# Altium schematic sheet Sensors.SchDoc
size A4; SheetNumber: 2; SheetTotal: 4
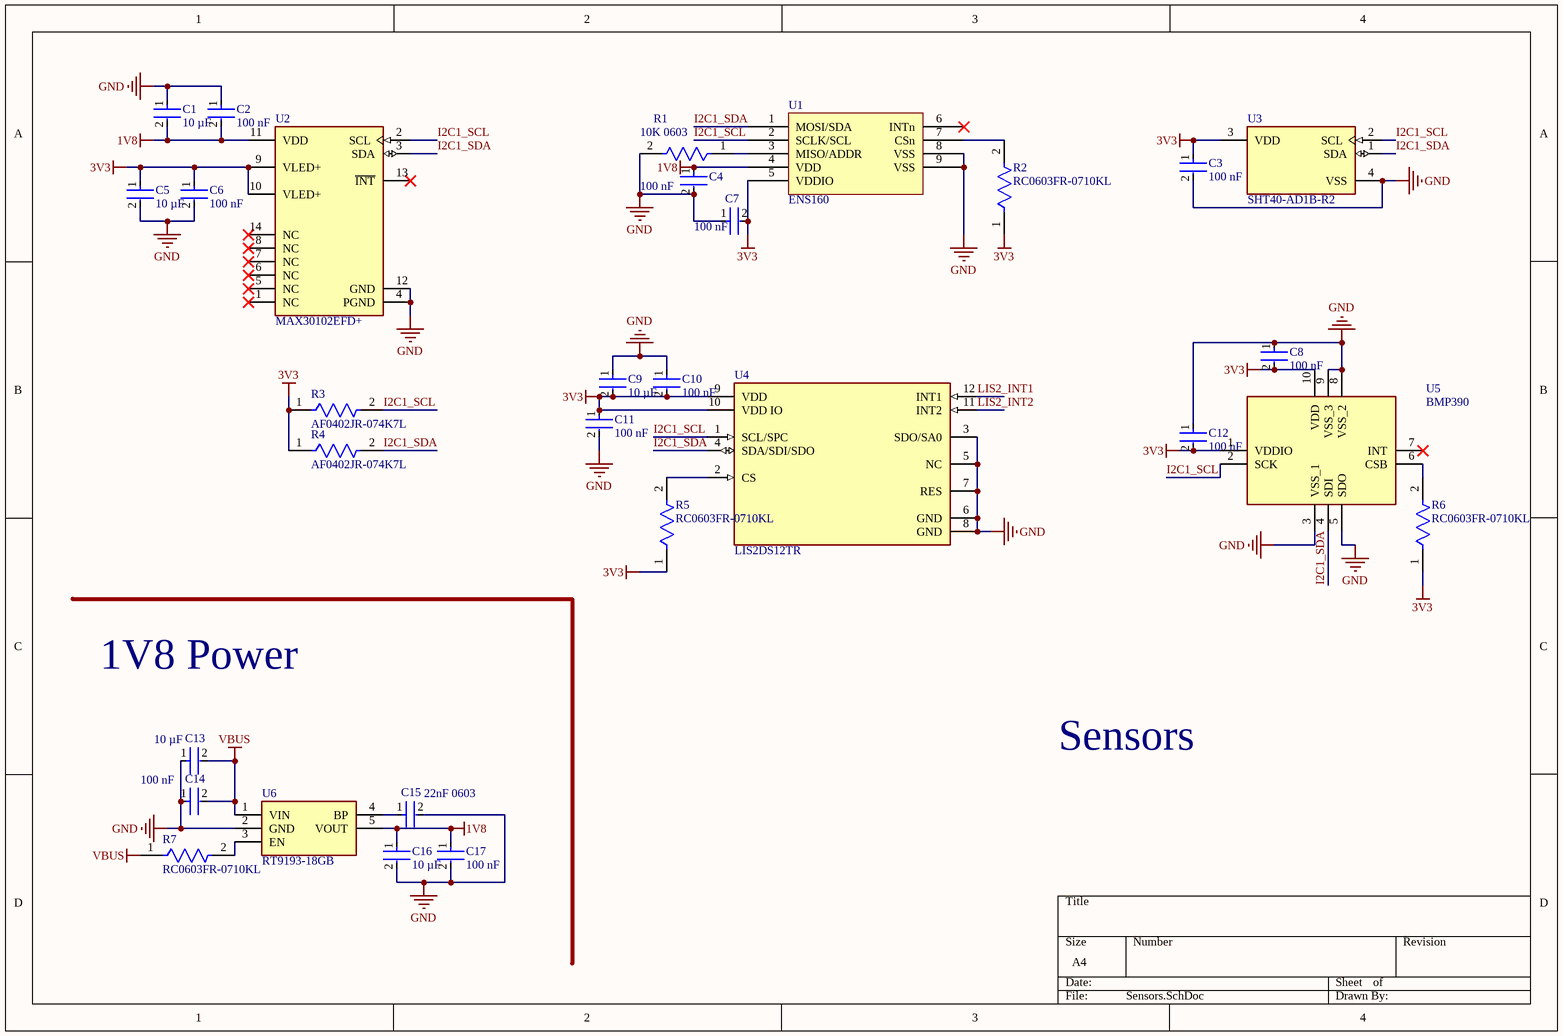
[diagram p0: Sensors.SchDoc]

## Parts
C1  10 µF  [FP-CL10-IPC_C]
C2  100 nF  [FP-CL10-IPC_A]
C3  100 nF  [FP-CL10-IPC_A]
C4  100 nF  [FP-CL10-IPC_A]
C5  10 µF  [FP-CL10-IPC_C]
C6  100 nF  [FP-CL10-IPC_A]
C7  100 nF  [FP-CL10-IPC_A]
C8  100 nF  [FP-CL10-IPC_A]
C9  10 µF  [FP-CL10-IPC_C]
C10  100 nF  [FP-CL10-IPC_A]
C11  100 nF  [FP-CL10-IPC_A]
C12  100 nF  [FP-CL10-IPC_A]
C13  10 µF  [FP-CL10-IPC_C]
C14  100 nF  [FP-CL10-IPC_A]
C15  22nF 0603  [FP-0603-L_1_6_0_15-W_0_81-IPC_C]
C16  10 µF  [FP-CL10-IPC_C]
C17  100 nF  [FP-CL10-IPC_A]
R1  10K 0603  [FP-RC0603-0_55-IPC_C]
R2  RC0603FR-0710KL  [FP-RC0603-0_55-IPC_C]
R3  AF0402JR-074K7L  [FP-AF0402-IPC_B]
R4  AF0402JR-074K7L  [FP-AF0402-IPC_B]
R5  RC0603FR-0710KL  [FP-RC0603-0_55-IPC_C]
R6  RC0603FR-0710KL  [FP-RC0603-0_55-IPC_C]
R7  RC0603FR-0710KL  [FP-RC0603-0_55-IPC_C]
U1  ENS160  [ENS_160]
U2  MAX30102EFD+  [FP-F143A5-1-MFG]
U3  SHT40-AD1B-R2  [FP-SHT40-AD1B-R2-MFG]
U4  LIS2DS12TR  [FP-LGA12_8566956-MFG]
U5  BMP390  [BMP390]
U6  RT9193-18GB  [SOT94P279X130-5N]

## Nets
1V8: C1.2 C2.2 C4.1 C16.1 C17.1 U1.4(VDD) U2.11(VDD) U6.5(VOUT)
3V3: C3.1 C5.1 C6.1 C7.2 C8.2 C9.2 C10.2 C11.1 C12.2 R2.1 R3.1 R4.1 R5.1 R6.1 U1.5(VDDIO) U2.9(VLED+) U2.10(VLED+) U3.3(VDD) U4.9(VDD) U4.10(VDD_IO) U5.1(VDDIO) U5.10(VDD)
GND: C1.1 C2.1 C3.2 C4.2 C5.2 C6.2 C7.1 C8.1 C9.1 C10.1 C11.2 C12.1 C13.1 C14.1 C15.2 C16.2 C17.2 R1.2 U1.8(VSS) U1.9(VSS) U2.4(PGND) U2.12(GND) U3.4(VSS) U4.3(SDO/SA0) U4.5(NC) U4.6(GND) U4.7(RES) U4.8(GND) U5.3(VSS_1) U5.5(SDO) U5.8(VSS_2) U5.9(VSS_3) U6.2(GND)
VBUS: C13.2 C14.2 R7.1 U6.1(VIN)
I2C1_SCL: R3.2 U1.2(SCLK/SCL) U2.2(SCL) U3.2(SCL) U4.1(SCL/SPC) U5.2(SCK)
I2C1_SDA: R4.2 U1.1(MOSI/SDA) U2.3(SDA) U3.1(SDA) U4.4(SDA/SDI/SDO) U5.4(SDI)
LIS2_INT1: U4.12(INT1)
LIS2_INT2: U4.11(INT2)
NetC15_1: C15.1 U6.4(BP)
NetR1_1: R1.1 U1.3(MISO/ADDR)
NetR2_2: R2.2 U1.7(CSn)
NetR5_2: R5.2 U4.2(CS)
NetR6_2: R6.2 U5.6(CSB)
NetR7_2: R7.2 U6.3(EN)

Not connected (* = marked no-connect by the designer): U1 6(INTn)*; U2 1(NC)* 5(NC)* 6(NC)* 7(NC)* 8(NC)* 13(~{INT})* 14(NC)*; U5 7(INT)*

## Notes on the sheet
- 1V8 Power
- Sensors

## Library data of the parts
C1 C5 C9 C13 C16 = CMP-13271-004224-1: Cap Ceramic 10uF 25V X5R ±20% Pad SMD 0603 +85°C T/R; Width: 0.031inch; Voltage Rating: 25V; Length: 0.063inch; Case Code (Metric): 1608; Dielectric: X5R; Termination: Wraparound; Capacitance: 10uF; Lead Free: Lead Free; Mount: Surface Mount; Package Quantity: 1; Case Code (Imperial): 0603; Thickness: 0.035inch; Packaging: Tape and Reel; Contact Plating: Tin; Min Operating Temperature: -55°C; Tolerance: 20%; Max Operating Temperature: 85°C; Case/Package: 0603
C2-C4 C6-C8 C10-C12 C14 C17 = CMP-13271-004036-1: Cap Ceramic 100nF 100V X7R ±10% Pad SMD 0603 +125°C T/R; Mount: Surface Mount; Packaging: Cut Tape; Width: 0.031inch; Thickness: 0.035inch; Length: 0.063inch; Tolerance: 10%; Min Operating Temperature: -55°C; Case/Package: 0603; Voltage Rating: 100V; Max Operating Temperature: 125°C; Case Code (Metric): 1608; Capacitance: 100nF; Case Code (Imperial): 0603
C15 = CMP-2006-04170-2: General Purpose Ceramic Capacitor, 0603, 22nF, 10%, X7R, 15%, 25V; Max Operating Temperature: 125°C; Lead Free: Lead Free; Voltage Rating (DC): 25V; Packaging: Tape and Reel; Thickness: 0.035inch; Length: 1.6mm; Series: -; Dielectric: X7R; Min Operating Temperature: -55°C; Mount: Surface Mount; Tolerance: 10%; Contact Plating: Tin; Construction: Flat; Package Quantity: 1; Case Code (Imperial): 0603; Number of Pins: 2; Termination: SMD/SMT; Case/Package: 0603; Radiation Hardening: No; Dielectric Material: Ceramic; Case Code (Metric): 1608; Width: 0.032inch; Height: 0.9mm; Depth: 0.81mm; Capacitance: 22nF; Voltage: 25V; RoHS Compliant: Yes; Voltage Rating: 25V
R1 R2 R5-R7 = CMP-2100-03664-2: RES 10K OHM 1% 1/10W 0603; Voltage Rating: 75V; Voltage Rating (DC): 50V; Resistance: 10kR; Power Rating: 100mW; Temperature Coefficient: 100ppm/°C; Depth: 0.8mm; Termination: SMD/SMT; Resistor Type: Thick Film; Series: RC; Construction: Rectangular; Features: Moisture Resistant; Packaging: Tape and Reel; Min Operating Temperature: -55°C; Number of Terminations: 2; Lead Pitch: 0.3mm; RoHS Compliant: Yes; Case/Package: 0603; Resistance Tolerance: 1%; Military Standard: Not; Weight: 7.1E-05oz; Number of Pins: 2; Tolerance: 1%; Length: 1.6mm; Case Code (Imperial): 0603; Lead Free: Lead Free; Width: 0.8mm; Max Power Dissipation: 100mW; Height: 0.45mm; Max Operating Temperature: 155°C; Case Code (Metric): 1608; Size Code: 0603
R3 R4 = CMP-03412-040740-1: Anti-Sulfurated Chip Resistors Automotive Grade 4.7kΩ 5% 100ppm/°C 0402; Voltage Rating: 50V; Power Rating: 62.5mW; Max Power Dissipation: 63mW; Resistance: 4.7kR; Width: 0.5mm; Case Code (Imperial): 0402; Package Quantity: 10000; Max Operating Temperature: 155°C; Features: Moisture Resistant; Length: 0.039inch; Height: 0.015inch; RoHS Compliant: Yes; Temperature Coefficient: 100ppm/°C; Resistor Type: Thick Film; Weight: 2.3E-05oz; Case Code (Metric): 1005; Packaging: Tape and Reel; Series: AF; Termination: SMD/SMT; Tolerance: 5%; Case/Package: 0402; Number of Terminations: 2; Min Operating Temperature: -55°C
U2 = CMP-05738-000003-1: IC SENSOR OXIMETER/HEARTRATE; Manufacturer: Maxim Integrated; Max Supply Voltage: 2V; Operating Supply Current: 600uA; Min Supply Voltage: 1.7V; Sensor Output: I2C; Max Junction Temp: +90°C; Category: IC; Automotive: No; Height: 1.65mm; Temperature Range Low: -40°C; Footprint Url: https://pdfserv.maximintegrated.com/land_patterns/90-0602.PDF; Octopart: https://octopart.com/max30102efd%2B-maxim+integrated-59568799; Temperature: -40°C to +85°C; ComponentLink2URL: https://datasheets.maximintegrated.com/en/ds/MAX30102.pdf; ComponentLink2Description: Datasheet; Device Class L3: unset; Device Class L2: unset; Mouser Description: Pulse Oximeter/Heart Rate Sensor, Oesip; Lead Free: Yes; Digikey Description: IC SENSOR OXIMETER/HEARTRATE; Package: F143A5-1; Manufacturer Part Number: MAX30102EFD+; RoHS: TRUE; Device Class L1: Sensors; Temperature Range High: +85°C
U3 = CMP-144040-000008-1: SENSOR HUMIDITY 100 RH SMD
U4 = CMP-12175-000010-1: ACCEL 2-16G I2C/SPI 12LGA; Operating Supply Voltage: 1.98V; Bandwidth: 6.25Hz; Axis: X, Y, Z; Output Type: SPI; Case/Package: LGA; Min Operating Temperature: -40°C; Lead Free: Lead Free; Mount: Surface Mount; Max Operating Temperature: 85°C; Contact Plating: Gold; Number of Pins: 12; Packaging: Tape and Reel
U5 = BMP390: Board Mount Pressure Sensors
U6 = RT9193-18GB: IC REG LINEAR 1.8V 300MA SOT23-5; Manufacturer_Name: RICHTEK; Geometry.Height: 1.295mm; Manufacturer_Part_Number: RT9193-18GB; Mouser Part Number: *; Mouser Price/Stock: *; Arrow Part Number: *; Arrow Price/Stock: *; Datasheet Link: http://www.richtek.com/assets/product_file/RT9193/DS9193-17.pdf